# EAGLE schematic untitled (EAGLE 5.07)
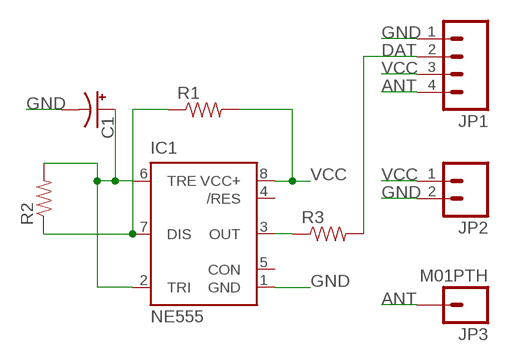
[diagram p0: schematic, sheet 1]

## Parts
C1  CAP_POLPTH2  [CPOL-RADIAL-10UF-25V]
IC1  NE555  [DIL-08]
JP1  M04SMD  [1X04-SMD]
JP2  M02PTH  [1X02]
JP3  M01PTH  [1X01]
R1  RESISTOR1206  [1206]
R2  RESISTOR1206  [1206]
R3  RESISTOR1206  [1206]

## Nets
ANT: JP1.4 JP3.1
DAT: JP1.2 R3.2
GND: C1.2(-) IC1.1(GND) JP1.1 JP2.2
N$1: IC1.3(OUT) R3.1
N$2: IC1.7(DIS) R1.1 R2.1
N$13: C1.1(+) IC1.2(TRI) IC1.6(TRE) R2.2
VCC: IC1.8(VCC+) JP1.3 JP2.1 R1.2
Unconnected: IC1.4(/RES) IC1.5(CON)

## Library data of the parts
C1 = SparkFun:CAP_POL: Capacitor Polarized These are standard SMD and PTH capacitors. Normally 10uF, 47uF, and 100uF in electrolytic and tantalum varieties. Always verify the external diameter of the through hole cap, it varies with capacity, voltage, and manufacturer. The EIA devices should be standard.
IC1 = st-microelectronics:NE555: General purpose bipolar Timer
JP1 = SparkFun:M04: Header 4 Standard 4-pin 0.1" header. Use with straight break away headers (SKU : PRT-00116), right angle break away headers (PRT-00553), swiss pins (PRT-00743), machine pins (PRT-00117), and female headers (PRT-00115). Molex polarized connector foot print use with SKU : PRT-08231 with associated crimp pins and housings.
JP2 = SparkFun:M02: Header 2 Standard 2-pin 0.1" header. Use with straight break away headers (SKU : PRT-00116), right angle break away headers (PRT-00553), swiss pins (PRT-00743), machine pins (PRT-00117), and female headers (PRT-00115). Molex polarized connector foot print use with SKU : PRT-08233 with associated crimp pins and housings.
JP3 = SparkFun:M01: Header 1 Standard 1-pin 0.1" header. Use with straight break away headers (SKU : PRT-00116), right angle break away headers (PRT-00553), swiss pins (PRT-00743), machine pins (PRT-00117), and female headers (PRT-00115).
R1-R3 = SparkFun:RESISTOR: Resistor Basic schematic elements and footprints for 0603, 1206, and PTH 1/10th watt (small) resistors.